# EAGLE design pikeyboard-56SWD2 (EAGLE 7.6.0)
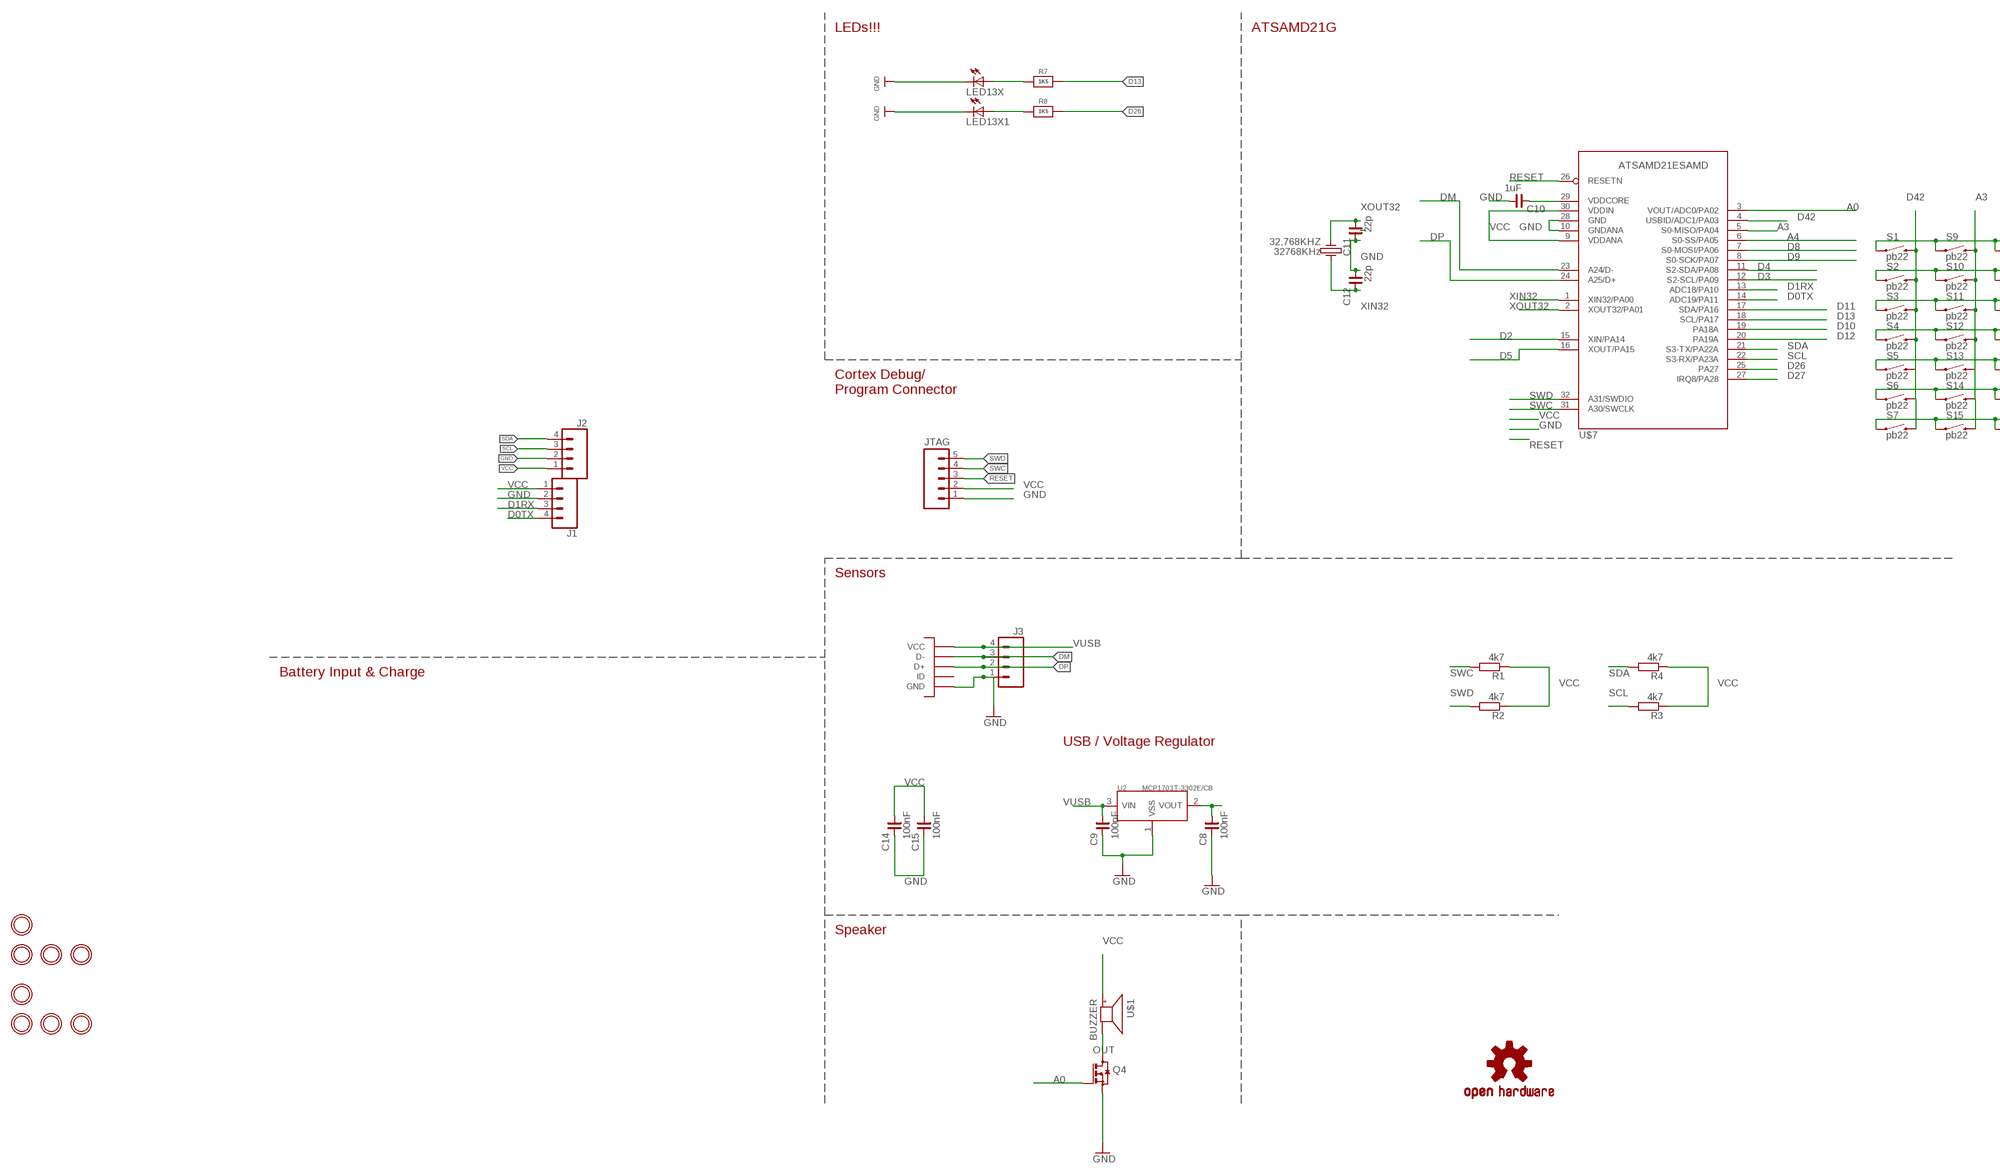
[diagram p0: schematic, sheet 1, part 1 of 2]
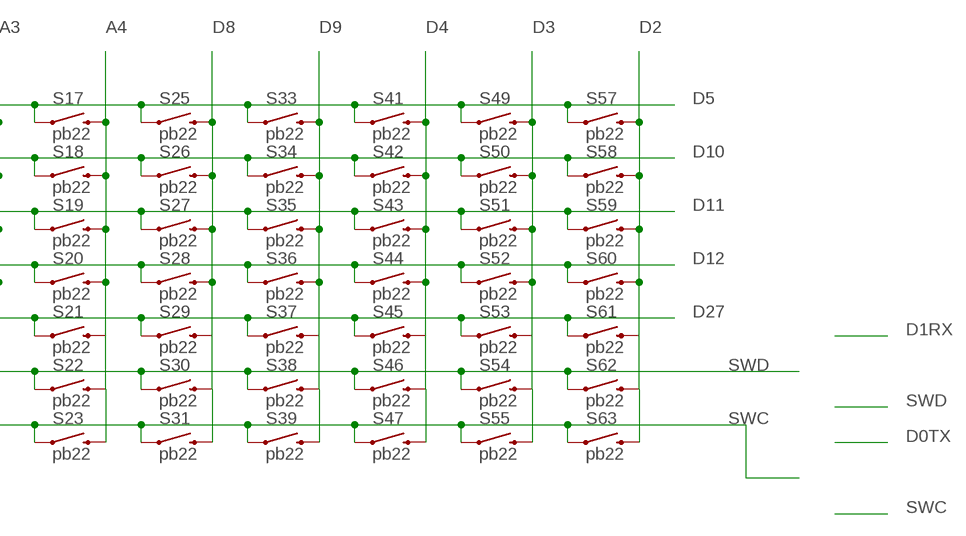
[diagram p1: schematic, sheet 1, part 2 of 2]

## Parts
32,768KHZ  32768KHz  CRYSTALL  [KX-327LT]
C8  100nF  C_0603  [C0603]
C9  100nF  C_0603  [C0603]
C10  1uF  C_0603  [C0603]
C11  22p  C_0603  [C0603]
C12  22p  C_0603  [C0603]
C14  100nF  C_0603  [C0603]
C15  100nF  C_0603  [C0603]
J1  CONN_041X04_NO_SILK  [1X04_NO_SILK]
J2  CONN_041X04_NO_SILK  [1X04_NO_SILK]
J3  CONN_041.27MM  [1X04_1.27MM]
JTAG  M051.27MM  [1X05-1.27MM]
LED13X  LED3MM  [LED3MM]
LED13X1  LED3MM  [LED3MM]
LOGO3  OSHW-LOGOS  [OSHW-LOGO-S]
Q4  BSS123  [SOT23]
R1  4k7  R-EU_R0603  [R0603]
R2  4k7  R-EU_R0603  [R0603]
R3  4k7  R-EU_R0603  [R0603]
R4  4k7  R-EU_R0603  [R0603]
R7  1K5  RESISTOR_0603_NOOUT  [0603-NO]
R8  1K5  RESISTOR_0603_NOOUT  [0603-NO]
S1  pb22  SWITCH-MOMENTARY-2PTH  [TACTILE-PTH]
S2  pb22  SWITCH-MOMENTARY-2PTH  [TACTILE-PTH]
S3  pb22  SWITCH-MOMENTARY-2PTH  [TACTILE-PTH]
S4  pb22  SWITCH-MOMENTARY-2PTH  [TACTILE-PTH]
S5  pb22  SWITCH-MOMENTARY-2PTH  [TACTILE-PTH]
S6  pb22  SWITCH-MOMENTARY-2PTH  [TACTILE-PTH]
S7  pb22  SWITCH-MOMENTARY-2PTH  [TACTILE-PTH]
S9  pb22  SWITCH-MOMENTARY-2PTH  [TACTILE-PTH]
S10  pb22  SWITCH-MOMENTARY-2PTH  [TACTILE-PTH]
S11  pb22  SWITCH-MOMENTARY-2PTH  [TACTILE-PTH]
S12  pb22  SWITCH-MOMENTARY-2PTH  [TACTILE-PTH]
S13  pb22  SWITCH-MOMENTARY-2PTH  [TACTILE-PTH]
S14  pb22  SWITCH-MOMENTARY-2PTH  [TACTILE-PTH]
S15  pb22  SWITCH-MOMENTARY-2PTH  [TACTILE-PTH]
S17  pb22  SWITCH-MOMENTARY-2PTH  [TACTILE-PTH]
S18  pb22  SWITCH-MOMENTARY-2PTH  [TACTILE-PTH]
S19  pb22  SWITCH-MOMENTARY-2PTH  [TACTILE-PTH]
S20  pb22  SWITCH-MOMENTARY-2PTH  [TACTILE-PTH]
S21  pb22  SWITCH-MOMENTARY-2PTH  [TACTILE-PTH]
S22  pb22  SWITCH-MOMENTARY-2PTH  [TACTILE-PTH]
S23  pb22  SWITCH-MOMENTARY-2PTH  [TACTILE-PTH]
S25  pb22  SWITCH-MOMENTARY-2PTH  [TACTILE-PTH]
S26  pb22  SWITCH-MOMENTARY-2PTH  [TACTILE-PTH]
S27  pb22  SWITCH-MOMENTARY-2PTH  [TACTILE-PTH]
S28  pb22  SWITCH-MOMENTARY-2PTH  [TACTILE-PTH]
S29  pb22  SWITCH-MOMENTARY-2PTH  [TACTILE-PTH]
S30  pb22  SWITCH-MOMENTARY-2PTH  [TACTILE-PTH]
S31  pb22  SWITCH-MOMENTARY-2PTH  [TACTILE-PTH]
S33  pb22  SWITCH-MOMENTARY-2PTH  [TACTILE-PTH]
S34  pb22  SWITCH-MOMENTARY-2PTH  [TACTILE-PTH]
S35  pb22  SWITCH-MOMENTARY-2PTH  [TACTILE-PTH]
S36  pb22  SWITCH-MOMENTARY-2PTH  [TACTILE-PTH]
S37  pb22  SWITCH-MOMENTARY-2PTH  [TACTILE-PTH]
S38  pb22  SWITCH-MOMENTARY-2PTH  [TACTILE-PTH]
S39  pb22  SWITCH-MOMENTARY-2PTH  [TACTILE-PTH]
S41  pb22  SWITCH-MOMENTARY-2PTH  [TACTILE-PTH]
S42  pb22  SWITCH-MOMENTARY-2PTH  [TACTILE-PTH]
S43  pb22  SWITCH-MOMENTARY-2PTH  [TACTILE-PTH]
S44  pb22  SWITCH-MOMENTARY-2PTH  [TACTILE-PTH]
S45  pb22  SWITCH-MOMENTARY-2PTH  [TACTILE-PTH]
S46  pb22  SWITCH-MOMENTARY-2PTH  [TACTILE-PTH]
S47  pb22  SWITCH-MOMENTARY-2PTH  [TACTILE-PTH]
S49  pb22  SWITCH-MOMENTARY-2PTH  [TACTILE-PTH]
S50  pb22  SWITCH-MOMENTARY-2PTH  [TACTILE-PTH]
S51  pb22  SWITCH-MOMENTARY-2PTH  [TACTILE-PTH]
S52  pb22  SWITCH-MOMENTARY-2PTH  [TACTILE-PTH]
S53  pb22  SWITCH-MOMENTARY-2PTH  [TACTILE-PTH]
S54  pb22  SWITCH-MOMENTARY-2PTH  [TACTILE-PTH]
S55  pb22  SWITCH-MOMENTARY-2PTH  [TACTILE-PTH]
S57  pb22  SWITCH-MOMENTARY-2PTH  [TACTILE-PTH]
S58  pb22  SWITCH-MOMENTARY-2PTH  [TACTILE-PTH]
S59  pb22  SWITCH-MOMENTARY-2PTH  [TACTILE-PTH]
S60  pb22  SWITCH-MOMENTARY-2PTH  [TACTILE-PTH]
S61  pb22  SWITCH-MOMENTARY-2PTH  [TACTILE-PTH]
S62  pb22  SWITCH-MOMENTARY-2PTH  [TACTILE-PTH]
S63  pb22  SWITCH-MOMENTARY-2PTH  [TACTILE-PTH]
U2  MCP1703T-3302E/CB  XC6206  [SOT23]
U$1  BUZZER  [SMT-8585-BUZZER]
U$2  MOUNTINGHOLE2.0  [MOUNTINGHOLE_2.0_PLATED]
U$3  MOUNTINGHOLE2.0  [MOUNTINGHOLE_2.0_PLATED]
U$4  MOUNTINGHOLE2.0  [MOUNTINGHOLE_2.0_PLATED]
U$5  MICROUSB  [MICRO_B]
U$7  ATSAMD21ESAMD  [TQFP32-08]
U$8  MOUNTINGHOLE2.0  [MOUNTINGHOLE_2.0_PLATED]
U$10  MOUNTINGHOLE2.0  [MOUNTINGHOLE_2.0_PLATED]
U$11  MOUNTINGHOLE2.0  [MOUNTINGHOLE_2.0_PLATED]
U$12  MOUNTINGHOLE2.0  [MOUNTINGHOLE_2.0_PLATED]
U$13  MOUNTINGHOLE2.0  [MOUNTINGHOLE_2.0_PLATED]

## Nets
A0: Q4.1(G) U$7.3(VOUT/ADC0/PA02)
A3: S9.3 S10.3 S11.3 S12.3 S13.3 S14.3 S15.3 U$7.5(S0-MISO/PA04)
A4: S17.3 S18.3 S19.3 S20.3 S21.3 S22.3 S23.3 U$7.6(S0-SS/PA05)
D0TX: J1.4 U$7.14(ADC19/PA11)
D1RX: J1.3 U$7.13(ADC18/PA10)
D2: S57.3 S58.3 S59.3 S60.3 S61.3 S62.3 S63.3 U$7.15(XIN/PA14)
D3: S49.3 S50.3 S51.3 S52.3 S53.3 S54.3 S55.3 U$7.12(S2-SCL/PA09)
D4: S41.3 S42.3 S43.3 S44.3 S45.3 S46.3 S47.3 U$7.11(S2-SDA/PA08)
D5: S1.1 S9.1 S17.1 S25.1 S33.1 S41.1 S49.1 S57.1 U$7.16(XOUT/PA15)
D8: S25.3 S26.3 S27.3 S28.3 S29.3 S30.3 S31.3 U$7.7(S0-MOSI/PA06)
D9: S33.3 S34.3 S35.3 S36.3 S37.3 S38.3 S39.3 U$7.8(S0-SCK/PA07)
D10: S2.1 S10.1 S18.1 S26.1 S34.1 S42.1 S50.1 S58.1 U$7.19(PA18A)
D11: S3.1 S11.1 S19.1 S27.1 S35.1 S43.1 S51.1 S59.1 U$7.17(SDA/PA16)
D12: S4.1 S12.1 S20.1 S28.1 S36.1 S44.1 S52.1 S60.1 U$7.20(PA19A)
D13: R7.1 U$7.18(SCL/PA17)
D26: R8.1 U$7.25(PA27)
D27: S5.1 S13.1 S21.1 S29.1 S37.1 S45.1 S53.1 S61.1 U$7.27(IRQ8/PA28)
D42: S1.3 S2.3 S3.3 S4.3 S5.3 S6.3 S7.3 U$7.4(USBID/ADC1/PA03)
DM: J3.3 U$5.P2(D-) U$7.23(A24/D-)
DP: J3.2 U$5.P3(D+) U$7.24(A25/D+)
GND [vcc]: C8.2 C9.2 C10.1 C11.2 C12.1 C14.2 C15.2 J1.2 J2.2 J3.1 JTAG.1 LED13X1.K(C) LED13X.K(C) Q4.2(S) U2.1(VSS) U$5.GND1(GND) U$5.GND2(GND) U$5.GND3(GND) U$5.GND4(GND) U$5.GND7(GND) U$5.GND8(GND) U$5.P5(GND) U$7.10(GNDANA) U$7.28(GND)
N$7: LED13X1.A R8.2
N$11: C10.2 U$7.29(VDDCORE)
N$22: LED13X.A R7.2
OUT: Q4.3(D) U$1.-
RESET: JTAG.3 U$7.26(RESETN)
SCL: J2.3 R3.2 U$7.22(S3-RX/PA23A)
SDA: J2.4 R4.2 U$7.21(S3-TX/PA22A)
SWC: JTAG.4 R1.2 S7.1 S15.1 S23.1 S31.1 S39.1 S47.1 S55.1 S63.1 U$7.31(A30/SWCLK)
SWD: JTAG.5 R2.2 S6.1 S14.1 S22.1 S30.1 S38.1 S46.1 S54.1 S62.1 U$7.32(A31/SWDIO)
VCC [gnd]: C8.1 C14.1 C15.1 J1.1 J2.1 JTAG.2 R1.1 R2.1 R3.1 R4.1 U2.2(VOUT) U$1.+ U$7.9(VDDANA) U$7.30(VDDIN)
VUSB: C9.1 J3.4 U2.3(VIN) U$5.P1(VCC)
XIN32: 32,768KHZ.1 C12.2 U$7.1(XIN32/PA00)
XOUT32: 32,768KHZ.4 C11.1 U$7.2(XOUT32/PA01)
Unconnected: U$5.P4(ID)

## Notes on the sheet
- LEDs!!! | ATSAMD21G
- Cortex Debug/
  Program Connector
- Sensors
- Battery Input & Charge
- USB / Voltage Regulator
- Speaker

## Library data of the parts
32,768KHZ = es:CRYSTALL
C8-C12 C14 C15 = rc-master-smd:C_: NON-POLARIZED CAP
J1 J2 = SparkFun-Connectors:CONN_04: Multi connection point. Often used as Generic Header-pin footprint for 0.1 inch spaced/style header connections On any of the 0.1 inch spaced packages, you can populate with these: Break Away Headers - Straight <https://www.sparkfun.com/products/116> (PRT-00116) Break Away Male Headers - Right Angle <https://www.sparkfun.com/products/553> (PRT-00553) Female Headers <https://www.sparkfun.com/products/115> (PRT-00115) Break Away Headers - Machine Pin <https://www.sparkfun.com/products/117> (PRT-00117) Break Away Female Headers - Swiss Machine Pin <https://www.sparkfun.com/products/743> (PRT-00743) For SCREWTERMINALS and SPRING TERMINALS visit here: Screw Terimnals on SparkFun.com <https://www.sparkfun.com/search/results?term=Screw+Terminals> (5mm/3.5mm/2.54mm spacing) This device is also useful as a general connection point to wire up your design to another part of your project. Our various solder wires solder well into these plated through hole pads. Hook-Up Wire - Assortment (Stranded, 22 AWG) <https://www.sparkfun.com/products/11375> (PRT-11375) Hook-Up Wire - Assortment (Solid Core, 22 AWG) <https://www.sparkfun.com/products/11367> (PRT-11367) View the entire wire category on our website here <https://www.sparkfun.com/categories/141> Special notes: Molex polarized connector foot print use with SKU : PRT-08231 with associated crimp pins and housings. 1MM SMD Version SKU: PRT-10208; PROD_ID: CONN-09696
J3 = SparkFun-Connectors:CONN_04: Multi connection point. Often used as Generic Header-pin footprint for 0.1 inch spaced/style header connections On any of the 0.1 inch spaced packages, you can populate with these: Break Away Headers - Straight <https://www.sparkfun.com/products/116> (PRT-00116) Break Away Male Headers - Right Angle <https://www.sparkfun.com/products/553> (PRT-00553) Female Headers <https://www.sparkfun.com/products/115> (PRT-00115) Break Away Headers - Machine Pin <https://www.sparkfun.com/products/117> (PRT-00117) Break Away Female Headers - Swiss Machine Pin <https://www.sparkfun.com/products/743> (PRT-00743) For SCREWTERMINALS and SPRING TERMINALS visit here: Screw Terimnals on SparkFun.com <https://www.sparkfun.com/search/results?term=Screw+Terminals> (5mm/3.5mm/2.54mm spacing) This device is also useful as a general connection point to wire up your design to another part of your project. Our various solder wires solder well into these plated through hole pads. Hook-Up Wire - Assortment (Stranded, 22 AWG) <https://www.sparkfun.com/products/11375> (PRT-11375) Hook-Up Wire - Assortment (Solid Core, 22 AWG) <https://www.sparkfun.com/products/11367> (PRT-11367) View the entire wire category on our website here <https://www.sparkfun.com/categories/141> Special notes: Molex polarized connector foot print use with SKU : PRT-08231 with associated crimp pins and housings. 1MM SMD Version SKU: PRT-10208
JTAG = SparkFun-Connectors:M05: Header 5 Standard 5-pin 0.1" header. Use with straight break away headers (SKU : PRT-00116), right angle break away headers (PRT-00553), swiss pins (PRT-00743), machine pins (PRT-00117), and female headers (PRT-00115). Molex polarized connector foot print use with SKU : PRT-08230 with associated crimp pins and housings.
LED13X LED13X1 = led:LED: LED OSRAM: - CHIPLED LG R971, LG N971, LY N971, LG Q971, LY Q971, LO R971, LY R971 LH N974, LH R974 LS Q976, LO Q976, LY Q976 LO Q996 - Hyper CHIPLED LW Q18S LB Q993, LB Q99A, LB R99A - SideLED LS A670, LO A670, LY A670, LG A670, LP A670 LB A673, LV A673, LT A673, LW A673 LH A674 LY A675 LS A676, LA A676, LO A676, LY A676, LW A676 LS A679, LY A679, LG A679 - Hyper Micro SIDELED® LS Y876, LA Y876, LO Y876, LY Y876 LT Y87S - SmartLED LW L88C, LW L88S LB L89C, LB L89S, LG L890 LS L89K, LO L89K, LY L89K LS L896, LA L896, LO L896, LY L896 - TOPLED LS T670, LO T670, LY T670, LG T670, LP T670 LSG T670, LSP T670, LSY T670, LOP T670, LYG T670 LG T671, LOG T671, LSG T671 LB T673, LV T673, LT T673, LW T673 LH T674 LS T676, LA T676, LO T676, LY T676, LB T676, LH T676, LSB T676, LW T676 LB T67C, LV T67C, LT T67C, LS T67K, LO T67K, LY T67K, LW E67C LS E67B, LA E67B, LO E67B, LY E67B, LB E67C, LV E67C, LT E67C LW T67C LS T679, LY T679, LG T679 LS T770, LO T770, LY T770, LG T770, LP T770 LB T773, LV T773, LT T773, LW T773 LH T774 LS E675, LA E675, LY E675, LS T675 LS T776, LA T776, LO T776, LY T776, LB T776 LHGB T686 LT T68C, LB T68C - Hyper Mini TOPLED® LB M676 - Mini TOPLED Santana® LG M470 LS M47K, LO M47K, LY M47K Source: http://www.osram.convergy.de LUXEON: - LUMILED® LXK2-PW12-R00, LXK2-PW12-S00, LXK2-PW14-U00, LXK2-PW14-V00 LXK2-PM12-R00, LXK2-PM12-S00, LXK2-PM14-U00 LXK2-PE12-Q00, LXK2-PE12-R00, LXK2-PE12-S00, LXK2-PE14-T00, LXK2-PE14-U00 LXK2-PB12-K00, LXK2-PB12-L00, LXK2-PB12-M00, LXK2-PB14-N00, LXK2-PB14-P00, LXK2-PB14-Q00 LXK2-PR12-L00, LXK2-PR12-M00, LXK2-PR14-Q00, LXK2-PR14-R00 LXK2-PD12-Q00, LXK2-PD12-R00, LXK2-PD12-S00 LXK2-PH12-R00, LXK2-PH12-S00 LXK2-PL12-P00, LXK2-PL12-Q00, LXK2-PL12-R00 Source: www.luxeon.com KINGBRIGHT: KA-3528ASYC Source: www.kingbright.com
LOGO3 = SparkFun-Aesthetics:OSHW-LOGO: Open Source Hardware Logo This logo indicates the piece of hardware it is found on incorporates a OSHW license and/or adheres to the definition of open source hardware found here: http://freedomdefined.org/OSHW
Q4 = transistor-small-signal:BSS123: N-CHANNEL MOS FET
R1-R4 = rcl:R-EU_: RESISTOR, European symbol
R7 R8 = microbuilder:RESISTOR: Resistors For new designs, use the packages preceded by an '_' character since they are more reliable: The following footprints should be used on most boards: _0402 - Standard footprint for regular board layouts _0603 - Standard footprint for regular board layouts _0805 - Standard footprint for regular board layouts _1206 - Standard footprint for regular board layouts For extremely tight-pitch boards where space is at a premium, the following 'micro-pitch' footprints can be used (smaller pads, no silkscreen outline, etc.): _0402MP - Micro-pitch footprint for very dense/compact boards _0603MP - Micro-pitch footprint for very dense/compact boards _0805MP - Micro-pitch footprint for very dense/compact boards _1206MP - Micro-pitch footprint for very dense/compact boards
S1-S7 S9-S15 S17-S23 S25-S31 S33-S39 S41-S47 S49-S55 S57-S63 = SparkFun-Electromechanical:SWITCH-MOMENTARY-2: Various NO switches- pushbuttons, reed, etc; PROD_ID: SWCH-08441
U2 = xc6206:XC6206
U$1 = adafruit:BUZZER
U$2-U$4 U$8 U$10-U$13 = microbuilder:MOUNTINGHOLE: Mounting Hole For #2 screws (0.086"/2.18mm width, 0.094"/2.4mm hole) use 2.5mm; BOM: EXCLUDE
U$5 = Other:MICROUSB
U$7 = atsamd21E:ATSAMD21E

## Net classes
0 default: width 0.203 mm, drill 0.356 mm, clearance 0.203 mm
1 vcc: width 0.203 mm, drill 0.356 mm, clearance 0.203 mm
2 gnd: width 0.203 mm, drill 0.356 mm, clearance 0.203 mm

## Board
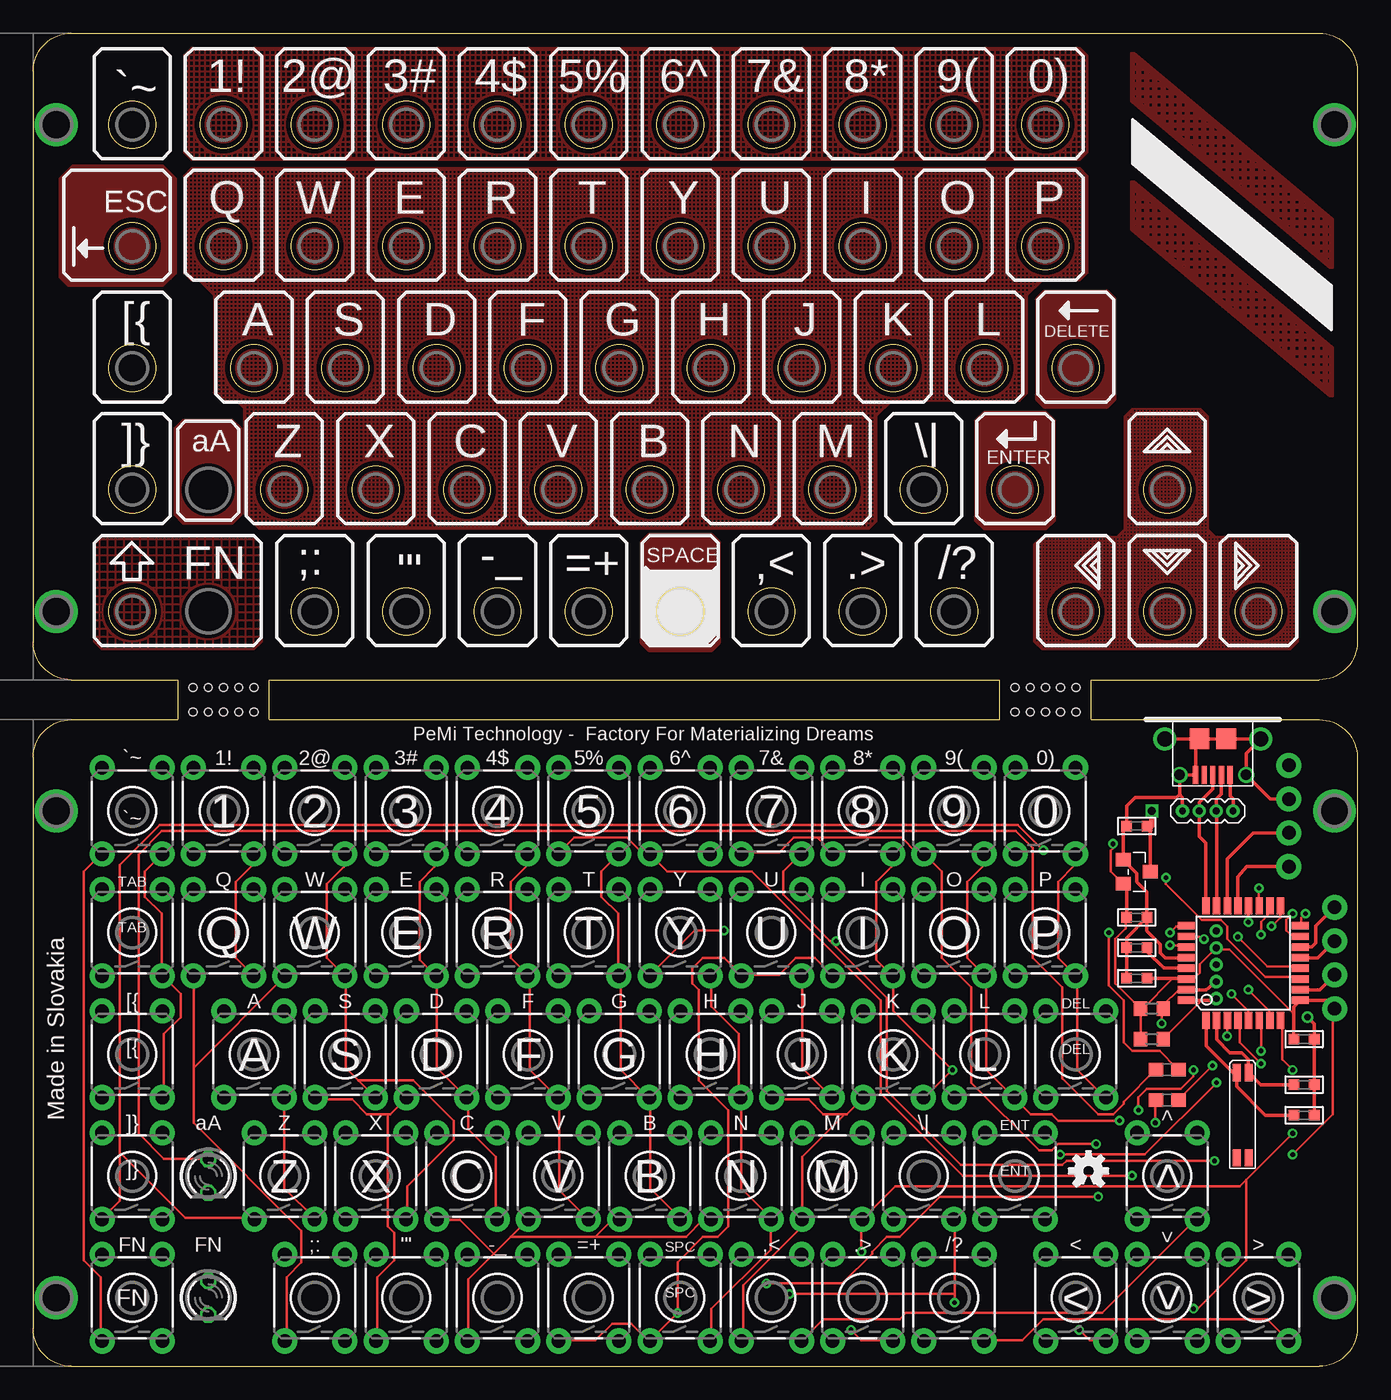
[diagram p2: board, top side]
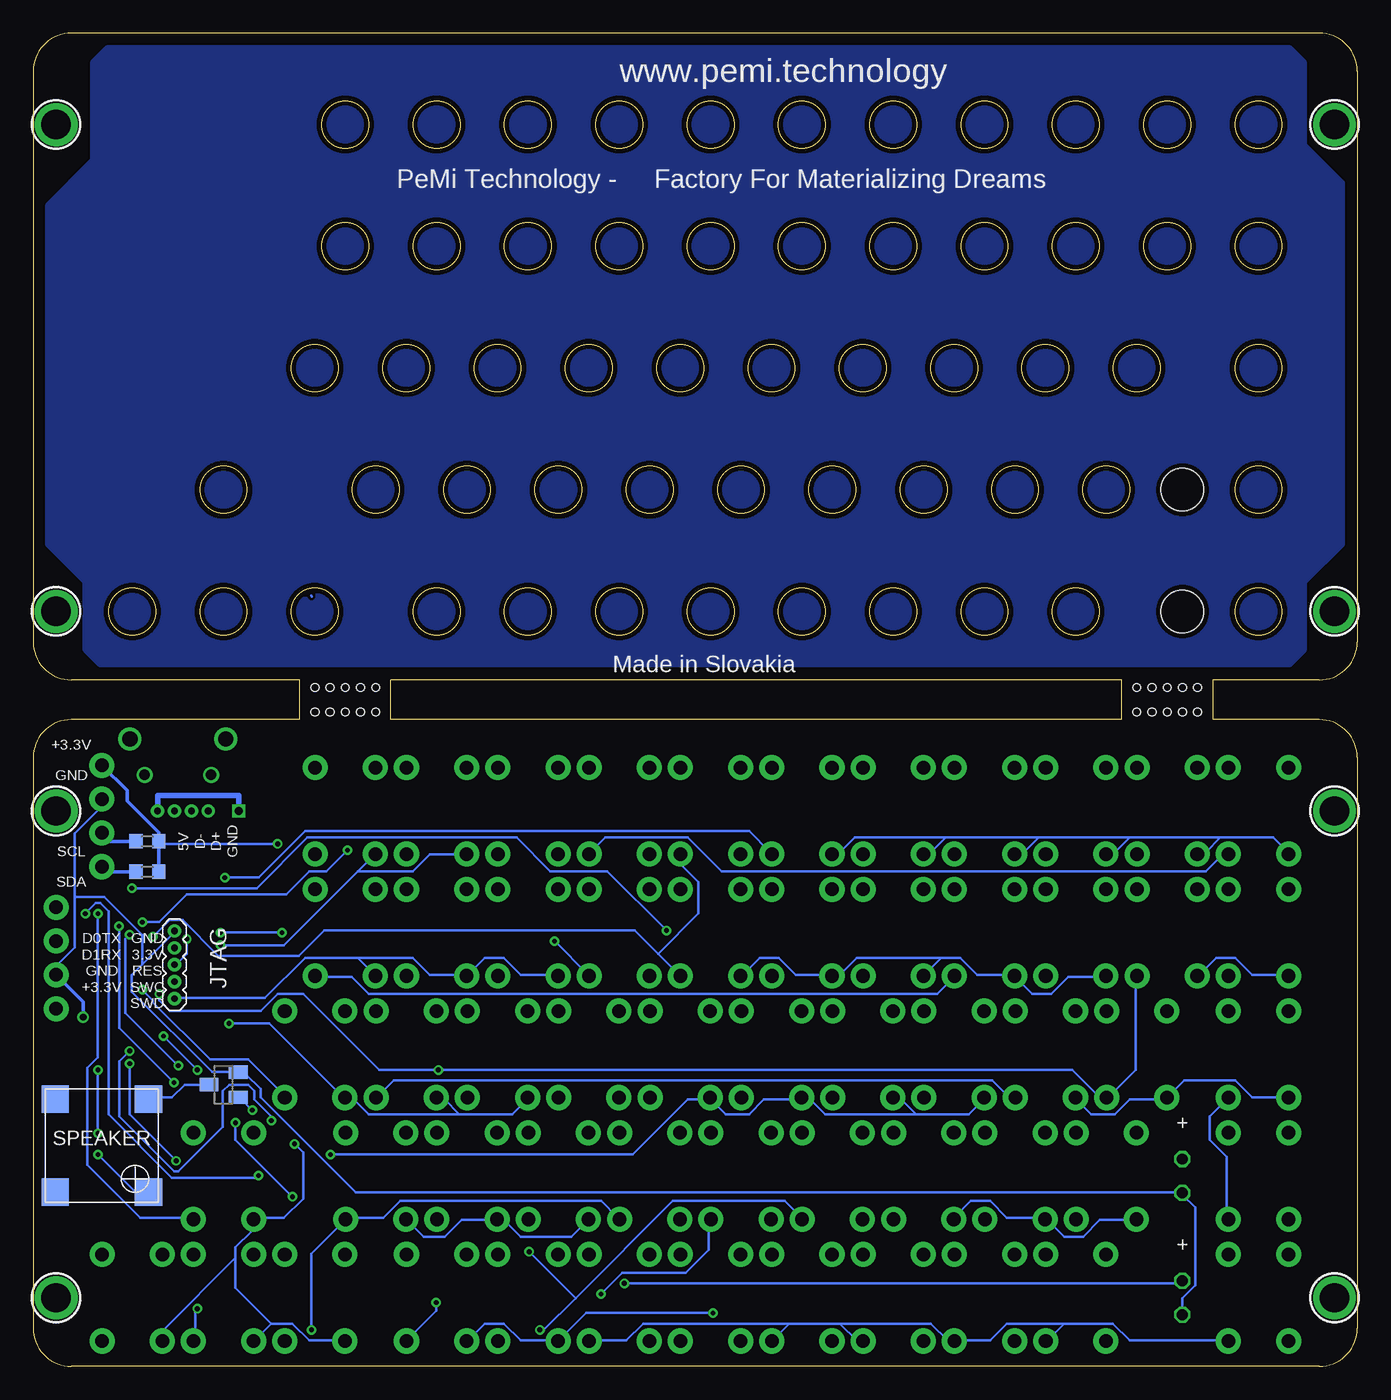
[diagram p3: board, bottom side, seen from below]

Size 99.44 x 100.14 mm. Coordinates in mm from the lower left corner, seen from the top.
Outline: 0,45.72 0,2.86 arc90 2.86,0 96.58,0 arc90 99.44,2.86 99.44,45.72 arc90 96.58,48.58 79.44,48.58 79.44,51.56 96.58,51.56 arc90 99.44,54.42 99.44,97.28 arc90 96.58,100.14 2.86,100.14 arc90 0,97.28 0,54.42 arc90 2.86,51.56 10.86,51.56 10.86,48.58 2.86,48.58 arc90 0,45.72
Outline: 17.72,48.58 72.58,48.58 72.58,51.56 17.72,51.56 17.72,48.58
Outline: circle at 14.29,84.14 radius 1.77
Outline: circle at 21.15,84.14 radius 1.77
Outline: circle at 28,84.14 radius 1.77
Outline: circle at 34.86,84.14 radius 1.77
Outline: circle at 41.72,84.14 radius 1.77
Outline: circle at 48.58,84.14 radius 1.77
Outline: circle at 55.44,84.14 radius 1.77
Outline: circle at 62.29,84.14 radius 1.77
Outline: circle at 69.15,84.14 radius 1.77
Outline: circle at 76.01,84.14 radius 1.77
Outline: circle at 16.57,74.99 radius 1.77
Outline: circle at 23.43,74.99 radius 1.77
Outline: circle at 30.29,74.99 radius 1.77
Outline: circle at 37.15,74.99 radius 1.77
Outline: circle at 44.01,74.99 radius 1.77
Outline: circle at 50.86,74.99 radius 1.77
Outline: circle at 57.72,74.99 radius 1.77
Outline: circle at 64.58,74.99 radius 1.77
Outline: circle at 71.44,74.99 radius 1.77
Outline: circle at 78.3,74.99 radius 1.77
Copper layers (1*16): Top 0.0356mm / dielectric 1.5011mm / Bottom 0.0356mm
Design rules "LaenPCBOrder *": minimum track width 6mil, minimum drill 13mil, track to track 6mil, track to pad 6mil, pad to pad 6mil, via to via 6mil, smd to smd 6mil, copper to edge 15mil, drill to drill 6mil, minimum pad ring 7mil, minimum via ring 7mil, stop-mask expansion 4mil, vias tented up to drill 30mil, thermal gap 10mil
Holes 0.6 mm at 12,50.99 13.14,50.99 14.29,50.99 15.43,50.99 16.57,50.99 12,49.15 13.14,49.15 14.29,49.15 15.43,49.15 16.57,49.15 73.72,50.99 74.87,50.99 76.01,50.99 77.15,50.99 78.3,50.99 73.72,49.15 74.87,49.15 76.01,49.15 77.15,49.15 78.3,49.15
Holes 3.2 mm at 13.14,56.71 13.14,65.85
tRestrict: area -0.5,46.4 to 101.2,49.2; area -2.2,-2.8 to 103.4,1.2
bRestrict: area -3.4,46.4 to 101.2,49.2; area -2.2,-2.8 to 103.4,1.2

### Footprints (pad centres in the part's own frame; a part is rotated, then mirrored left to right if it is on the bottom)
KX-327LT = smd 1.3 x 0.6: 1 -3.2,-0.5; 2 3.2,-0.5; 3 3.2,0.4; 4 -3.2,0.4
C0603 = smd 0.8 x 0.8: 1 -0.762,0; 2 0.762,0
1X04_NO_SILK = drill 1.016 pad 1.88: 1 0,0; 2 2.54,0; 3 5.08,0; 4 7.62,0
1X04_1.27MM = drill 0.508 pad 1: 1 0,0; 2 1.27,0; 3 2.54,0; 4 3.81,0
1X05-1.27MM = drill 0.508 pad 1: 1 0,0; 2 1.27,0; 3 2.54,0; 4 3.81,0; 5 5.08,0
LED3MM = drill 0.813 octagon: A -1.27,0; K 1.27,0
SOT23 = smd 1 x 1.4: 1 -0.95,-1.1; 2 0.95,-1.1; 3 0,1.1
R0603 = smd 1 x 1.1: 1 -0.85,0; 2 0.85,0
0603-NO = smd 1.1 x 1: 1 -0.85,0; 2 0.85,0
TACTILE-PTH = drill 1.016 pad 1.88: 1 -3.251,2.261; 2 3.251,2.261; 3 -3.251,-2.261; 4 3.251,-2.261
SOT23' = smd 1.016 x 1.143: 1 -0.889,-1.016; 2 0.889,-1.016; 3 0,1.016
SMT-8585-BUZZER = smd 2.05 x 2.05: + -3.5,-3.5; - 3.5,-3.5; NC1 -3.5,3.5; NC2 3.5,3.5
MOUNTINGHOLE_2.0_PLATED = drill 2.2 pad 3: P$1 0,0
MICRO_B = smd 1.5 x 1.55: GND1 -1,1.45; GND2 1,1.45 | drill 0.8: GND3 -2.5,4.15; GND4 2.5,4.15 | drill 1.15: GND7 -3.598,1.45; GND8 3.598,1.45 | smd 0.4 x 1.35: P1 -1.3,4.15; P2 -0.65,4.15; P3 0,4.15; P4 0.65,4.15; P5 1.3,4.15
TQFP32-08 = smd 1.27 x 0.559: 1 -4.293,2.8; 2 -4.293,2; 3 -4.293,1.2; 4 -4.293,0.4; 5 -4.293,-0.4; 6 -4.293,-1.2; 7 -4.293,-2; 8 -4.293,-2.8; 17 4.293,-2.8; 18 4.293,-2; 19 4.293,-1.2; 20 4.293,-0.4; 21 4.293,0.4; 22 4.293,1.2; 23 4.293,2; 24 4.293,2.8 | smd 0.559 x 1.27: 9 -2.8,-4.293; 10 -2,-4.293; 11 -1.2,-4.293; 12 -0.4,-4.293; 13 0.4,-4.293; 14 1.2,-4.293; 15 2,-4.293; 16 2.8,-4.293; 25 2.8,4.293; 26 2,4.293; 27 1.2,4.293; 28 0.4,4.293; 29 -0.4,4.293; 30 -1.2,4.293; 31 -2,4.293; 32 -2.8,4.293

### Placement (x,y rotation side)
32,768KHZ  90.87,18.86 270 top
C8  82.87,33.72 0 top
C9  82.87,40.58 180 top
C10  82.87,31.43 0 top
C11  95.44,21.15 0 top
C12  95.44,18.86 180 top
C14  82.87,29.15 180 top
C15  95.44,24.57 0 top
J1  97.73,26.86 90 top
J2  94.3,45.15 270 top
J3  86.3,41.72 0 top
JTAG  88.84,32.7 270 bottom
LED13X  13.14,5.14 270 top
LED13X1  13.14,14.29 270 top
LOGO3  79.25,14.67 0 top
Q4  85.15,21.15 90 bottom
R1  84.01,26.86 0 top
R2  84.01,24.57 0 top
R3  90.87,39.43 180 bottom
R4  90.87,37.15 180 bottom
R7  85.15,20 180 top
R8  85.15,22.29 180 top
S1  7.43,41.72 90 top
S2  7.43,32.58 90 top
S3  7.43,23.43 90 top
S4  7.43,14.29 90 top
S5  55.44,41.72 90 top
S6  55.44,32.58 90 top
S7  57.72,23.43 90 top
S9  14.29,41.72 90 top
S10  14.29,32.58 90 top
S11  16.57,23.43 90 top
S12  18.86,14.29 90 top
S13  62.29,41.72 90 top
S14  62.29,32.58 90 top
S15  64.58,23.43 90 top
S17  21.15,41.72 90 top
S18  21.15,32.58 90 top
S19  23.43,23.43 90 top
S20  25.72,14.29 90 top
S21  69.15,41.72 90 top
S22  69.15,32.58 90 top
S23  71.44,23.43 90 top
S25  28,41.72 90 top
S26  28,32.58 90 top
S27  30.29,23.43 90 top
S28  32.58,14.29 90 top
S29  76.01,41.72 90 top
S30  76.01,32.58 90 top
S31  78.3,23.43 90 top
S33  34.86,41.72 90 top
S34  34.86,32.58 90 top
S35  37.15,23.43 90 top
S36  39.43,14.29 90 top
S37  85.15,5.14 90 top
S38  62.29,5.14 90 top
S39  60.01,14.29 90 top
S41  41.72,41.72 90 top
S42  41.72,32.58 90 top
S43  44.01,23.43 90 top
S44  46.29,14.29 90 top
S45  92.01,5.14 90 top
S46  69.15,5.14 90 top
S47  66.87,14.29 90 top
S49  48.58,41.72 90 top
S50  48.58,32.58 90 top
S51  50.86,23.43 90 top
S52  53.15,14.29 90 top
S53  78.3,5.14 90 top
S54  48.58,5.14 90 top
S55  73.72,14.29 90 top
S57  7.43,5.14 90 top
S58  21.15,5.14 90 top
S59  28,5.14 90 top
S60  34.86,5.14 90 top
S61  85.15,14.29 90 top
S62  41.72,5.14 90 top
S63  55.44,5.14 90 top
U2  MCP1703T-3302E/CB  [SOT23']  82.87,37.15 270 top
U$1  94.3,16.57 90 bottom
U$2  1.71,5.14 0 bottom
U$3  97.73,5.14 0 bottom
U$4  97.73,41.72 0 bottom
U$5  88.58,48.58 180 top
U$7  90.87,30.29 90 top
U$8  1.71,93.28 90 bottom
U$10  1.71,41.72 0 bottom
U$11  1.71,56.71 90 bottom
U$12  97.73,56.71 90 bottom
U$13  97.73,93.28 90 bottom

### Tracks (layer width: path | path; a pad name or v marks a point on that pad's centre or on a via)
A0  (via drill 0.36)
  Top 0.203: v89.66,24.8 89.66,25.91 U$7.3 | v87.12,22.26 87.12,21.78 86.17,20.83 83.63,20.83 82.99,20.19 v82.99,19.24
  Bottom 0.203: v87.12,22.26 v89.66,24.8 | v82.99,19.24 83.95,20.19 Q4.1
A3  (via drill 0.36)
  Top 0.203: S11.3 18.86,20.03 18.86,13.37 21.08,11.14 S12.3 | S9.3 16.48,38.45 16.48,37.66 15.21,36.39 15.21,30.67 16.48,29.4 S10.3 | v89.98,27.97 91.25,26.7 91.25,26.07 U$7.5 | S15.3 66.96,20.19 v69.02,22.26 64.58,26.7 64.58,29.24 S14.3 64.42,29.4 63.31,30.51 63.31,36.39 64.42,37.5 64.42,38.45 S13.3
  Bottom 0.203: S10.3 16.64,29.24 16.64,22.26 18.7,20.19 S11.3 18.86,20.19 19.34,20.19 21.4,22.26 v69.02,22.26 73.47,22.26 79.18,27.97 81.09,27.97 82.36,26.7 89.19,26.7 89.98,27.5 v89.98,27.97
A4  (via drill 0.36)
  Top 0.203: 24.42,21.46 25.69,20.19 S19.3 | 24.42,21.46 23.46,22.42 23.46,29.24 S18.3 23.3,29.4 22.03,30.67 22.03,36.23 23.3,37.5 23.3,38.45 S17.3 | 24.42,21.46 28.54,21.46 31.56,18.45 31.56,17.02 28.07,13.53 28.07,11.14 S20.3 | v92.2,23.69 92.2,25.91 U$7.6 | v81.57,18.45 76.96,18.45 76.49,18.92 74.9,18.92 73.79,20.03 S23.3 73.63,20.19 71.56,22.26 71.56,29.24 S22.3 71.41,29.4 70.14,30.67 70.14,36.39 71.41,37.66 71.41,38.45 S21.3
  Bottom 0.203: v92.2,23.69 93,22.89 93,18.76 88.87,14.64 88.55,14.64 85.22,17.97 85.22,20.67 84.74,21.15 83.31,21.15 82.84,20.67 82.84,20.03 81.57,18.76 v81.57,18.45 | S19.3 25.84,20.19 26.16,20.19 27.43,21.46 72.36,21.46 73.63,20.19 S23.3
D0TX
  Top 0.254: U$7.14 96.01,31.49 96.33,31.81 96.33,33.08 J1.4
D1RX
  Top 0.254: U$7.13 96.48,30.69 J1.3
D2  (via drill 0.36)
  Top 0.203: v94.58,34 94.11,33.53 94.11,32.73 94.42,32.42 95.06,32.42 U$7.15 | S61.3 87.28,10.99 80.3,4 65.53,4 65.06,3.52 59.34,3.52 57.75,1.94 S63.3
  Bottom 0.203: v94.58,34 94.58,23.21 95.38,22.42 95.38,15.11 91.41,11.14 87.44,11.14 S61.3 | 22.03,3.21 18.38,3.21 17.11,1.94 9.81,1.94 S57.3 | 22.03,3.21 23.3,1.94 S58.3 | 22.03,3.21 26.32,3.21 27.59,1.94 30.13,1.94 S59.3 30.29,1.94 30.77,1.94 32.04,3.21 38.86,3.21 | 38.86,3.21 37.59,1.94 37.27,1.94 S60.3 | 42.67,3.21 38.86,3.21 | 42.67,3.21 43.94,1.94 S62.3 | 42.67,3.21 53.63,3.21 54.9,1.94 57.59,1.94 S63.3
D3  (via drill 0.36)
  Top 0.203: S54.3 50.93,1.94 50.93,4.32 55.37,8.76 55.37,10.99 S52.3 55.37,11.14 53.15,13.37 53.15,20.03 S51.3 52.99,20.19 52.99,24.96 50.93,27.02 50.93,29.24 S50.3 | v78.55,2.73 79.34,1.94 80.45,1.94 S53.3 | v90.46,32.26 92.68,30.04 95.06,30.04 U$7.12
  Bottom 0.203: S52.3 55.53,11.14 56.8,12.41 71.88,12.41 73.15,11.14 75.85,11.14 S55.3 76.01,10.99 78.55,8.45 v78.55,2.73 | v90.46,32.26 89.19,33.53 88.23,33.53 85.53,30.83 79.5,30.83 77.6,32.73 54.26,32.73 52.51,30.99 | 52.51,30.99 50.93,29.4 S50.3 | 52.51,30.99 49.5,34 49.5,36.39 50.77,37.66 50.77,38.45 S49.3
D4  (via drill 0.36)
  Top 0.203: S46.3 71.56,1.94 74.26,1.94 75.85,3.52 92.68,3.52 94.27,1.94 S45.3 | v69.18,4.79 69.18,5.43 | 69.18,5.43 69.18,10.99 S47.3 | S44.3 48.55,11.14 46.32,13.37 46.32,20.03 S43.3 46.16,20.19 44.1,22.26 44.1,29.24 S42.3 43.94,29.4 43.94,34 42.67,35.27 42.67,37.18 43.94,38.45 S41.3 | v85.06,36.7 85.06,36.23 87.76,33.53 89.19,33.53 89.66,33.05 89.66,32.1 92.52,29.24 95.06,29.24 U$7.11 | v56.8,5.43 69.18,5.43
  Bottom 0.203: v69.18,4.79 69.18,4.16 71.41,1.94 S46.3 | v85.06,36.7 82.52,36.7 79.03,40.2 45.69,40.2 44.1,38.61 S41.3 | v56.8,5.43 55.21,7.02 50.45,7.02 48.7,8.76 48.7,10.99 S44.3
D5  (via drill 0.36)
  Top 0.203: v95.54,34 95.22,33.69 95.22,33.21 U$7.16 | v82.52,14.32 69.82,14.32 63.63,20.51 63.63,27.5 53.94,37.18 47.59,37.18 46.32,38.45 S49.1 46.16,38.61 45.69,38.61 44.58,39.72 40.61,39.72 39.5,38.61 S41.1 | S57.1 5.05,1.94 5.05,6.7 3.78,7.97 3.78,37.18 5.05,38.45 S1.1
  Bottom 0.203: v95.54,34 94.74,34.8 94.42,34.8 93.79,34.16 93.79,18.92 89.03,14.16 82.68,14.16 v82.52,14.32 | 10.29,39.72 11.4,38.61 11.87,38.61 S9.1 | 10.29,39.72 6.32,39.72 5.21,38.61 S1.1 | 17.11,39.72 18.22,38.61 18.86,38.61 S17.1 | 10.29,39.72 17.11,39.72 | 23.94,39.72 25.05,38.61 25.69,38.61 S25.1 | 17.11,39.72 23.94,39.72 | 30.92,39.72 32.04,38.61 32.51,38.61 S33.1 | 23.94,39.72 30.92,39.72 | 30.92,39.72 37.75,39.72 38.86,38.61 39.34,38.61 S41.1
D8  (via drill 0.36)
  Top 0.203: v91.25,28.29 92.84,26.7 92.84,26.07 U$7.7 | S31.3 80.45,20.19 78.39,22.26 78.39,29.24 S30.3 78.23,29.4 76.96,30.67 76.96,36.39 78.23,37.66 78.23,38.45 S29.3 | S25.3 30.13,38.45 30.13,37.5 29.02,36.39 29.02,30.51 30.13,29.4 S26.3 30.29,29.24 30.29,22.42 32.51,20.19 S27.3 32.67,20.03 32.67,17.81 34.73,15.75 34.73,11.14 S28.3
  Bottom 0.203: v91.25,28.29 90.46,27.5 90.46,27.34 86.17,23.05 83.31,23.05 80.45,20.19 S31.3 | S30.3 78.23,29.24 75.53,29.24 74.26,27.97 31.56,27.97 30.29,29.24 S26.3
D9  (via drill 0.36)
  Top 0.203: v94.58,22.26 93.79,23.05 93.79,25.91 U$7.8 | 91.09,14 90.61,13.53 64.74,13.53 62.36,11.14 S39.3 62.2,10.99 v62.2,8.6 | 91.09,14 v94.58,17.49 | v87.12,4.32 87.44,4.32 91.09,7.97 91.09,14 | v61.4,2.73 62.2,1.94 64.42,1.94 S38.3 | S36.3 41.56,11.14 39.5,13.21 39.5,20.03 S35.3 39.34,20.19 37.27,22.26 37.27,29.24 S34.3 37.12,29.4 35.85,30.67 35.85,36.39 37.12,37.66 37.12,38.45 S33.3
  Bottom 0.203: v94.58,17.49 v94.58,22.26 | v87.12,4.32 87.28,4.16 87.28,1.94 S37.3 | v61.4,2.73 61.09,2.73 58.71,5.11 | 58.71,5.11 51.4,12.41 42.99,12.41 41.72,11.14 S36.3 | 58.71,5.11 v62.2,8.6
D10  (via drill 0.36)
  Top 0.203: 12.03,22.42 12.03,29.24 S10.1 | 12.03,22.42 12.03,18.29 20.13,10.19 20.13,7.81 19.02,6.7 19.02,1.94 S58.1 | 12.03,22.42 18.86,29.24 S18.1 | v92.04,35.91 92.04,34.64 U$7.19 | v51.88,32.73 49.66,32.73 46.32,29.4 S50.1
  Bottom 0.203: S2.1 5.21,29.4 7.91,29.4 9.18,30.67 10.6,30.67 11.87,29.4 S10.1 | 31.24,30.67 29.81,30.67 28.54,29.4 25.84,29.4 S26.1 25.69,29.24 24.42,27.97 22.99,27.97 21.72,29.24 19.02,29.24 S18.1 | 31.24,30.67 32.51,29.4 S34.1 | 31.24,30.67 37.59,30.67 38.86,29.4 39.34,29.4 S42.1 39.5,29.4 42.2,29.4 43.47,30.67 44.89,30.67 46.16,29.4 S50.1 | v92.04,35.91 82.68,35.91 78.87,39.72 63.15,39.72 60.61,37.18 56.32,37.18 v51.88,32.73
D11  (via drill 0.36)
  Top 0.203: 26.64,18.92 26.8,18.92 27.91,20.03 S27.1 | 26.64,18.92 25.05,18.92 23.94,20.03 21.24,20.03 S19.1 | 26.64,18.92 26.64,10.51 27.11,10.03 27.11,7.97 25.84,6.7 25.84,1.94 S59.1 | v93,33.05 93.63,33.69 93.63,34.48 U$7.17 | v88.87,21.3 83.47,15.91 v77.12,15.91
  Bottom 0.203: S3.1 5.21,20.19 7.91,20.19 9.18,21.46 12.99,21.46 14.26,20.19 S11.1 14.41,20.03 17.11,20.03 18.22,18.92 19.97,18.92 21.08,20.03 S19.1 | 33.15,18.92 34.26,20.03 34.73,20.03 S35.1 | 33.15,18.92 29.18,18.92 28.07,20.03 S27.1 | 33.15,18.92 39.97,18.92 41.08,20.03 41.72,20.03 S43.1 41.88,20.03 44.58,20.03 45.69,18.92 47.43,18.92 48.55,20.03 S51.1 48.7,20.03 50.29,20.03 54.42,15.91 v77.12,15.91 | v93,33.05 93,25.43 v88.87,21.3
D12  (via drill 0.36)
  Top 0.203: 35.85,9.72 37.12,10.99 S36.1 | 35.85,9.72 34.58,8.45 | 34.58,8.45 32.67,6.54 32.67,1.94 S60.1 | 34.58,8.45 32.04,10.99 30.45,10.99 S28.1 | 42.2,9.72 43.47,10.99 43.94,10.99 S44.1 | 35.85,9.72 42.2,9.72 | 42.2,9.72 49.02,9.72 50.29,10.99 50.77,10.99 S52.1 | v91.25,33.37 91.25,34.48 U$7.20 | v75.85,38.77 73.95,40.67 9.49,40.67 6.48,37.66 6.48,16.07 | 6.48,16.07 6.48,12.41 5.21,11.14 S4.1 | 6.48,16.07 11.4,11.14 16.48,11.14 S12.1
  Bottom 0.203: S12.1 16.64,10.99 19.34,10.99 20.61,9.72 22.03,9.72 23.3,10.99 S20.1 23.46,11.14 26.32,11.14 27.59,12.41 29.02,12.41 30.29,11.14 S28.1 | v91.25,33.37 89.98,33.37 87.92,35.43 80.45,35.43 78.71,37.18 77.44,37.18 v75.85,38.77
D13  (via drill 0.36)
  Top 0.203: v88.55,22.57 86.01,20.03 R7.1 | v92.2,32.42 92.2,33.37 92.84,34 92.84,34.48 U$7.18
  Bottom 0.203: v88.55,22.57 92.52,26.54 92.52,32.1 v92.2,32.42
D26  (via drill 0.36)
  Top 0.203: v80.77,32.58 80.77,28.61 81.88,27.5 81.88,24.32 82.52,23.69 84.58,23.69 85.85,22.42 R8.1 | v85.38,32.58 85.85,33.05 86.49,33.05 U$7.25
  Bottom 0.203: v85.38,32.58 v80.77,32.58
D27  (via drill 0.36)
  Top 0.203: 58.86,39.72 57.12,39.72 56.01,38.61 53.31,38.61 S5.1 | 58.86,39.72 59.98,38.61 S13.1 | 58.86,39.72 65.21,39.72 66.33,38.61 66.8,38.61 S21.1 66.96,38.45 68.23,37.18 68.23,30.67 70.45,28.45 70.45,21.3 75.53,16.22 76.49,16.22 76.96,16.7 v79.82,16.7 | v85.38,31.62 86.49,31.62 U$7.27
  Bottom 0.203: 81.57,3.21 79.98,3.21 78.71,1.94 76.17,1.94 S53.1 | 81.57,3.21 82.84,1.94 S37.1 | 84.26,8.13 84.26,5.91 81.57,3.21 | 84.26,8.13 84.26,8.92 82.99,10.19 82.99,10.99 S61.1 82.84,11.14 80.61,11.14 79.18,12.57 79.18,16.07 v79.82,16.7 | 84.26,8.13 89.66,2.73 89.66,1.94 S45.1 | v85.38,31.62 80.61,31.62 75.06,37.18 | 75.06,37.18 73.79,38.45 S29.1 | 75.06,37.18 70.93,37.18 69.66,38.45 66.96,38.45 S21.1
D42  (via drill 0.36)
  Top 0.203: S1.3 9.65,38.45 8.38,37.18 8.38,35.27 9.65,34 9.65,29.4 S2.3 9.81,29.24 11.08,27.97 11.08,26.23 9.81,24.96 9.81,20.19 S3.3 | S6.3 57.75,29.24 57.75,22.42 59.98,20.19 S7.3 | v92.2,22.73 90.61,24.32 90.61,25.91 U$7.4 | v88.71,15.43 77.6,15.43 77.28,15.11 69.66,15.11 64.1,20.67 64.1,27.65 59.82,31.94 | 59.82,31.94 56.32,35.43 56.32,37.18 57.59,38.45 S5.3 | 59.82,31.94 v60.29,31.94
  Bottom 0.203: S4.3 9.81,11.14 9.81,15.75 11.08,17.02 11.08,18.76 9.81,20.03 S3.3 | v92.2,22.73 92.2,18.92 v88.71,15.43 | v60.29,31.94 57.75,29.4 S6.3 | S1.3 9.81,38.45 10.13,38.45 11.4,37.18 47.75,37.18 50.29,39.72 56.48,39.72 57.59,38.61 S5.3
DM
  Top 0.254: U$5.P2 89.23,43 88.84,42.61 J3.3 88.87,41.69 U$7.23
DP
  Top 0.254: U$5.P3 88.58,43.37 87.57,42.35 J3.2 87.57,39.81 88.07,39.31 U$7.24
GND  (via drill 0.5)
  Top 0.254: 86.08,42.95 U$5.GND4 U$5.P5 87.28,46.83 U$5.GND2 | 86.08,42.95 86.3,42.74 J3.1 | U$5.GND2 U$5.GND1 U$5.GND7 91.08,46.03 U$5.GND3 92.9,42.61 J2.2 | U$5.GND2 U$5.GND8 | 86.08,42.95 85.87,42.74 82.74,42.74 82.11,42.1 C9.2 81.85,40.32 U2.1 82.87,37.02 82.87,36.39 83.63,35.62 C8.2 | C8.2 82.11,32.19 C10.1 C14.2 | C8.2 83.63,32.7 84.65,31.69 84.65,31.05 85.03,30.67 86.56,30.67 U$7.28 | U$7.10 96.62,28.29 J1.2 | v95.69,26.23 96.2,25.72 C15.2 C11.2 C12.1
  Bottom 0.203: 96.33,35.27 96.33,40.04 94.42,41.94 94.42,42.58 J2.2 | 96.33,35.27 96.33,31.46 97.6,30.19 97.6,29.4 J1.2 | LED13X.K 13.14,5.11 12.19,6.06 12.19,11.94 13.14,12.89 LED13X1.K 13.14,13.05 75.22,13.05 82.36,20.19 82.36,20.83 83.47,21.94 83.95,21.94 Q4.2 84.11,22.1 86.01,22.1 92.04,28.13 92.04,29.4 91.25,30.19 | 91.25,30.19 88.87,32.58 JTAG.1 | 96.33,35.27 94.11,35.27 91.25,32.42 91.25,30.19
  Bottom 0.254: v95.69,26.23 95.69,27.37 J1.2
N$1
  pour Top (isolate 0.254, hatched): 11.33,89.46 11.89,90.02 78.58,90.02 79.15,89.46 79.15,82.11 78.58,81.55 75.76,81.55 74.63,80.42 74.63,73.07 74.06,72.5 64.45,72.5 63.32,71.37 63.32,63.46 62.76,62.9 16.98,62.9 15.85,64.03 15.85,71.94 15.28,72.5 14.15,72.5 13.59,73.07 13.59,80.42 12.46,81.55 11.89,81.55 11.33,82.11
N$2
  pour Top (isolate 0.254, hatched): 11.33,98.5 11.89,99.07 78.58,99.07 79.15,98.5 79.15,91.15 78.58,90.59 11.89,90.59 11.33,91.15
N$3
  pour Top (isolate 0.254, hatched): 75.19,61.76 75.76,62.33 81.41,62.33 81.97,62.89 81.97,71.37 82.54,71.94 87.62,71.94 88.19,71.37 88.19,62.89 88.75,62.33 94.41,62.33 94.97,61.76 94.97,54.42 94.41,53.85 75.76,53.85 75.19,54.42
N$5
  pour Top: 46.29,53.85 45.72,54.42 45.72,61.85 46.29,62.42 50.86,62.42 51.44,61.85 51.44,54.42 50.86,53.85
N$6
  pour Top: 70.87,70.99 71.44,71.56 76.01,71.56 76.58,70.99 76.58,63.56 76.01,62.99 71.44,62.99 70.87,63.56
N$7
  Top 0.203: R8.2 84.26,22.26 81.88,19.88 81.88,19.72 81.09,18.92 79.98,18.92 77.28,21.62 77.28,28.45 75.06,30.67 75.06,38.93 73.79,40.2 9.65,40.2 7.91,38.45 7.91,17.49 9.81,15.59 13.14,15.59 LED13X1.A
N$8
  pour Top: 75.44,80.14 76.01,80.71 80.58,80.71 81.15,80.14 81.15,72.71 80.58,72.14 76.01,72.14 75.44,72.71
N$9
  pour Top (isolate 0.254, hatched): 4.57,61.85 5.14,62.42 16.57,62.42 17.15,61.85 17.15,54.42 16.57,53.85 5.14,53.85 4.57,54.42
N$10
  Bottom 0.203: 78.55,57.91 78.54,57.84
N$10GG
  pour Bottom: 3.98,97.94 5.11,99.07 93.84,99.07 94.97,97.94 94.97,90.59 98.36,87.2 98.36,61.77 95.54,58.94 95.54,53.85 94.41,52.72 5.11,52.72 3.98,53.85 3.98,58.94 1.16,61.77 1.16,88.89 3.98,91.72
N$11
  Top 0.254: C10.2 83.63,31.18 84.9,29.91 86.56,29.91 U$7.29
N$12
  pour Top: 11.26,63.35 10.65,63.97 10.65,70.43 11.26,71.05 14.96,71.05 15.58,70.43 15.58,63.97 14.96,63.35
N$13
  pour Top: 2.03,89.22 2.95,90.14 9.73,90.14 10.65,89.22 10.65,82.14 9.73,81.21 2.64,81.21 2.03,81.83
N$14F
  pour Top (hatched): 82.56,85.41 97.47,72.92 97.47,76.47 82.56,88.96
N$14YUY
  pour Top (hatched): 82.56,95.06 97.47,82.57 97.47,86.13 82.56,98.62
N$22  (via drill 0.36)
  Top 0.203: v84.26,18.29 84.26,19.88 R7.2 | v79.98,12.73 68.07,12.73 65.06,9.72 64.1,9.72 62.99,8.6 62.99,8.45 60.77,6.22 v55.05,6.22
  Bottom 0.203: v84.26,18.29 84.26,17.02 v79.98,12.73 | v55.05,6.22 13.3,6.22 13.14,6.38 LED13X.A
OUT
  Bottom 0.203: Q4.3 88.07,21.15 89.03,20.19 90.77,20.19 U$1.-
RESET  (via drill 0.36)
  Top 0.203: v87.92,32.1 87.76,32.26 86.65,32.26 U$7.26
  Bottom 0.203: v87.92,32.1 87.92,30.99 88.71,30.19 JTAG.3
SCL
  Top 0.254: U$7.22 89.67,38.11 91.63,40.07 J2.3
  Bottom 0.254: R3.2 93.66,39.43 J2.3
SDA
  Top 0.254: U$7.21 90.47,36.75 91.12,37.53 J2.4
  Bottom 0.254: R4.2 93.92,37.15 J2.4
SWC  (via drill 0.36)
  Top 0.203: S63.1 53.31,1.94 53.31,6.06 57.59,10.35 57.59,10.99 S39.1 57.75,11.14 57.75,15.75 60.93,18.92 | U$7.31 86.49,28.29 86.01,28.29 84.9,27.18 84.9,26.86 R1.2 84.74,26.86 v84.74,25.75 | 60.93,18.92 61.09,18.92 62.2,20.03 S15.1 | 60.93,18.92 59.34,18.92 58.23,20.03 55.53,20.03 S7.1
  Top 0.254: U$7.31 88.11,28.29 JTAG.4
  Bottom 0.203: S55.1 71.41,10.99 70.14,9.72 68.55,9.72 67.28,10.99 64.74,10.99 S47.1 64.58,10.99 64.1,10.99 62.83,9.72 59.02,9.72 57.75,10.99 S39.1 | v84.74,25.75 81.72,25.75 76.17,20.19 S31.1 76.01,20.03 75.37,20.03 74.26,18.92 67.44,18.92 | 67.44,18.92 68.55,20.03 69.02,20.03 S23.1 | 67.44,18.92 63.47,18.92 62.36,20.03 S15.1
SWD  (via drill 0.36)
  Top 0.203: S62.1 39.5,1.94 42.2,1.94 43.47,3.21 44.89,3.21 46.16,1.94 S54.1 46.32,1.94 v48.39,4 48.39,7.81 50.29,9.72 51.4,9.72 52.2,10.51 52.2,19.24 49.97,21.46 49.97,28.29 49.5,28.77 49.5,29.88 50.29,30.67 51.88,30.67 53.15,29.4 S6.1 53.31,29.4 56.01,29.4 57.28,30.67 58.71,30.67 59.98,29.4 S14.1 | R2.2 84.9,24.64 87.76,27.5 87.76,27.49
  Top 0.254: U$7.32 87.76,27.49 88.58,27.49 JTAG.5
  Bottom 0.203: S46.1 66.8,1.94 65.53,3.21 64.1,3.21 62.83,1.94 60.13,1.94 S38.1 59.98,1.94 57.91,4 v48.39,4 | 75.06,30.67 79.03,30.67 82.04,27.65 88.71,27.65 JTAG.5 | 75.06,30.67 73.79,29.4 S30.1 | 75.06,30.67 70.93,30.67 69.66,29.4 66.96,29.4 S22.1 66.8,29.4 65.53,30.67 64.1,30.67 62.83,29.4 60.13,29.4 S14.1
VCC  (via drill 0.36)
  Top 0.203: R1.1 83.15,24.64 R2.1 | 85.53,29.15 85.53,29.08 83.31,26.86 R1.1 | R1.1 81.25,28.77 81.25,32.1 82.04,32.89 82.04,33.69 C8.1 | U$7.30 86.65,29.24 87.28,29.24 87.6,29.56 87.6,30.19 JTAG.2 88.87,31.31 89.82,31.31 94.58,26.54 94.68,26.54 | v94.58,15.91 97.6,18.92 97.6,26.86 J1.1 | v81.09,39.24 81.09,38.93 80.93,38.77 80.93,37.18 U2.2
  Top 0.254: C8.1 82.11,36 U2.2 | C14.1 85.53,29.15 86.52,29.15 U$7.30 | J1.1 97.1,27.49 U$7.9 94.68,27.01 94.68,26.54 C15.1
  Bottom 0.203: v94.58,15.91 91.88,13.21 90.93,13.21 U$1.+ | v81.09,39.24 89.98,39.24 R3.1
  Bottom 0.254: R4.1 R3.1 90.02,40.11 92.39,42.48 92.39,43.24 J2.1
VUSB  (via drill 0.6)
  Top 0.254: U$5.P1 89.88,42.83 90.11,42.61 J3.4 | U2.3 83.88,40.32 C9.1
  Top 0.406: v84.01,41.72 84.01,40.58 C9.1
  Bottom 0.406: J3.4 90.11,42.86 84.01,42.86 v84.01,41.72
XIN32
  Top 0.254: U$7.1 88.07,24.07 90.08,22.06 32,768KHZ.1 90.37,21.01 92.52,18.86 C12.2
XOUT32
  Top 0.254: U$7.2 88.87,24.54 89.85,23.56 90.74,23.56 91.25,23.05 91.25,22.08 32,768KHZ.4 92.18,21.15 C11.1

### Text on the board
tNames: 1! | 2@ | 3# | 4$ | 5% | 6^ | 7& | 8* | 9( | 0) | `~ | ESC | Q | W | E | R | T | Y | U | I | O | P | [{ | A | S | D | F | G | H | J | K | L | DELETE | ]} | aA | Z | X | C | V | B | N | M | \\| | ENTER | -_ | SPACE | FN | ;: | =+ | ,< | .> | /? | '" | PeMi Technology - Factory For Materializing Dreams | `~ | 1! | 2@ | 3# | 4$ | 5% | 6^ | 7& | 8* | 9( | 0) | 1 | 2 | 3 | 4 | 5 | 6 | 7 | 8 | 9 | 0 | `~ | TAB | Q | W | E | R | T | Y | U | I | O | P | TAB | Q | W | E | R | T | Y | U | I | O | P | [{ | A | S | D | F | G | H | J | K | L | DEL | Made in Slovakia | [{ | A | S | D | F | G | H | J | K | L | DEL | > | ]} | aA | Z | X | C | V | B | N | M | \\| | ENT | ]} | Z | X | C | V | B | N | M | ENT | > | < | FN | FN | ;: | '" | -_ | =+ | SPC | ,< | .> | /? | < | > | FN | SPC | < | < | >
bNames: www.pemi.technology | PeMi Technology - Factory For Materializing Dreams | Made in Slovakia | +3.3V | GND | 5V / D- / D+ / GND | SCL | SDA | GND / 3.3V / RES / SWC / SWD | D0TX / D1RX / GND / +3.3V | JTAG | + | SPEAKER | +